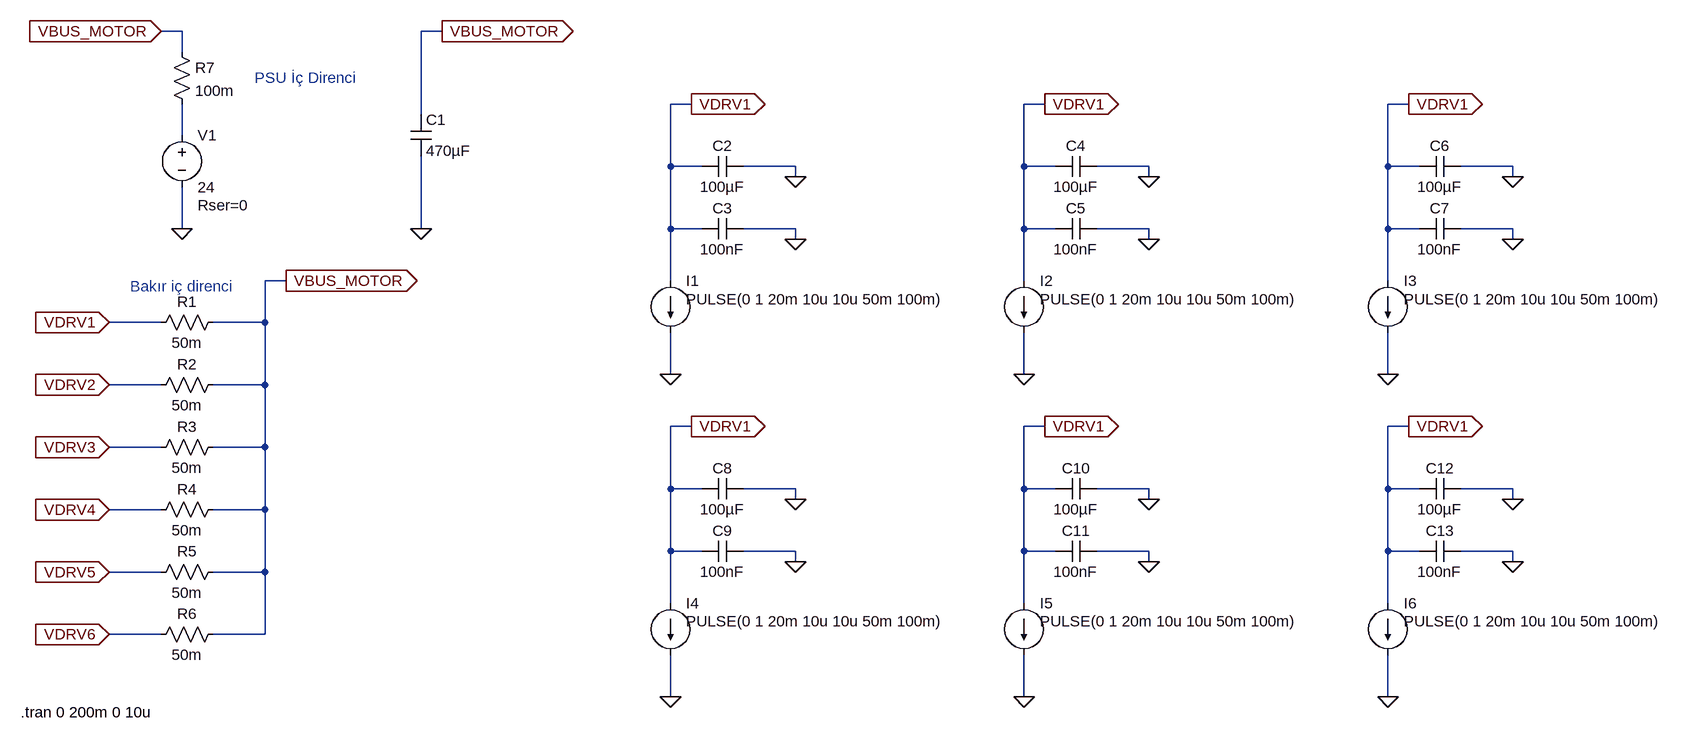
[diagram p0: schematic powerSupply.asc]
powerSupply.asc, the LTspice schematic file:
Version 4.1
SHEET 1 2448 996
WIRE -32 -336 -64 -336
WIRE 368 -336 336 -336
WIRE -32 -304 -32 -336
WIRE 752 -224 720 -224
WIRE 1296 -224 1264 -224
WIRE 1856 -224 1824 -224
WIRE 336 -208 336 -336
WIRE -32 -176 -32 -224
WIRE 720 -128 720 -224
WIRE 768 -128 720 -128
WIRE 912 -128 832 -128
WIRE 1264 -128 1264 -224
WIRE 1312 -128 1264 -128
WIRE 1456 -128 1376 -128
WIRE 1824 -128 1824 -224
WIRE 1872 -128 1824 -128
WIRE 2016 -128 1936 -128
WIRE 912 -112 912 -128
WIRE 1456 -112 1456 -128
WIRE 2016 -112 2016 -128
WIRE -32 -32 -32 -96
WIRE 336 -32 336 -144
WIRE 720 -32 720 -128
WIRE 768 -32 720 -32
WIRE 912 -32 832 -32
WIRE 1264 -32 1264 -128
WIRE 1312 -32 1264 -32
WIRE 1456 -32 1376 -32
WIRE 1824 -32 1824 -128
WIRE 1872 -32 1824 -32
WIRE 2016 -32 1936 -32
WIRE 912 -16 912 -32
WIRE 1456 -16 1456 -32
WIRE 2016 -16 2016 -32
WIRE 128 48 96 48
WIRE 720 48 720 -32
WIRE 1264 48 1264 -32
WIRE 1824 48 1824 -32
WIRE -64 112 -144 112
WIRE 96 112 96 48
WIRE 96 112 16 112
WIRE 720 192 720 128
WIRE 1264 192 1264 128
WIRE 1824 192 1824 128
WIRE -64 208 -144 208
WIRE 96 208 96 112
WIRE 96 208 16 208
WIRE 752 272 720 272
WIRE 1296 272 1264 272
WIRE 1856 272 1824 272
WIRE -64 304 -144 304
WIRE 96 304 96 208
WIRE 96 304 16 304
WIRE 720 368 720 272
WIRE 768 368 720 368
WIRE 912 368 832 368
WIRE 1264 368 1264 272
WIRE 1312 368 1264 368
WIRE 1456 368 1376 368
WIRE 1824 368 1824 272
WIRE 1872 368 1824 368
WIRE 2016 368 1936 368
WIRE 912 384 912 368
WIRE 1456 384 1456 368
WIRE 2016 384 2016 368
WIRE -64 400 -144 400
WIRE 96 400 96 304
WIRE 96 400 16 400
WIRE 720 464 720 368
WIRE 768 464 720 464
WIRE 912 464 832 464
WIRE 1264 464 1264 368
WIRE 1312 464 1264 464
WIRE 1456 464 1376 464
WIRE 1824 464 1824 368
WIRE 1872 464 1824 464
WIRE 2016 464 1936 464
WIRE 912 480 912 464
WIRE 1456 480 1456 464
WIRE 2016 480 2016 464
WIRE -64 496 -144 496
WIRE 96 496 96 400
WIRE 96 496 16 496
WIRE 720 544 720 464
WIRE 1264 544 1264 464
WIRE 1824 544 1824 464
WIRE -64 592 -144 592
WIRE 96 592 96 496
WIRE 96 592 16 592
WIRE 720 688 720 624
WIRE 1264 688 1264 624
WIRE 1824 688 1824 624
FLAG -64 -336 VBUS_MOTOR
IOPIN -64 -336 In
FLAG -144 112 VDRV1
IOPIN -144 112 In
FLAG -32 -32 0
FLAG 368 -336 VBUS_MOTOR
IOPIN 368 -336 Out
FLAG 336 -32 0
FLAG 128 48 VBUS_MOTOR
IOPIN 128 48 Out
FLAG 752 -224 VDRV1
IOPIN 752 -224 Out
FLAG 912 -112 0
FLAG 912 -16 0
FLAG 720 192 0
FLAG -144 208 VDRV2
IOPIN -144 208 In
FLAG -144 304 VDRV3
IOPIN -144 304 In
FLAG -144 400 VDRV4
IOPIN -144 400 In
FLAG -144 496 VDRV5
IOPIN -144 496 In
FLAG -144 592 VDRV6
IOPIN -144 592 In
FLAG 1296 -224 VDRV1
IOPIN 1296 -224 Out
FLAG 1456 -112 0
FLAG 1456 -16 0
FLAG 1264 192 0
FLAG 1856 -224 VDRV1
IOPIN 1856 -224 Out
FLAG 2016 -112 0
FLAG 2016 -16 0
FLAG 1824 192 0
FLAG 752 272 VDRV1
IOPIN 752 272 Out
FLAG 912 384 0
FLAG 912 480 0
FLAG 720 688 0
FLAG 1296 272 VDRV1
IOPIN 1296 272 Out
FLAG 1456 384 0
FLAG 1456 480 0
FLAG 1264 688 0
FLAG 1856 272 VDRV1
IOPIN 1856 272 Out
FLAG 2016 384 0
FLAG 2016 480 0
FLAG 1824 688 0
SYMBOL voltage -32 -192 R0
WINDOW 123 0 0 Left 0
WINDOW 39 24 124 Left 2
SYMATTR InstName V1
SYMATTR Value 24
SYMATTR SpiceLine Rser=0
SYMBOL cap 320 -208 R0
SYMATTR InstName C1
SYMATTR Value 470µF
SYMBOL res 32 96 R90
WINDOW 0 0 56 VBottom 2
WINDOW 3 32 56 VTop 2
SYMATTR InstName R1
SYMATTR Value 50m
SYMBOL cap 832 -144 R90
WINDOW 0 0 32 VBottom 2
WINDOW 3 32 32 VTop 2
SYMATTR InstName C2
SYMATTR Value 100µF
SYMBOL cap 832 -48 R90
WINDOW 0 0 32 VBottom 2
WINDOW 3 32 32 VTop 2
SYMATTR InstName C3
SYMATTR Value 100nF
SYMBOL current 720 48 R0
WINDOW 3 24 28 Left 2
WINDOW 123 0 0 Left 0
WINDOW 39 0 0 Left 0
SYMATTR InstName I1
SYMATTR Value PULSE(0 1 20m 10u 10u 50m 100m)
SYMBOL res 32 192 R90
WINDOW 0 0 56 VBottom 2
WINDOW 3 32 56 VTop 2
SYMATTR InstName R2
SYMATTR Value 50m
SYMBOL res 32 288 R90
WINDOW 0 0 56 VBottom 2
WINDOW 3 32 56 VTop 2
SYMATTR InstName R3
SYMATTR Value 50m
SYMBOL res 32 384 R90
WINDOW 0 0 56 VBottom 2
WINDOW 3 32 56 VTop 2
SYMATTR InstName R4
SYMATTR Value 50m
SYMBOL res 32 480 R90
WINDOW 0 0 56 VBottom 2
WINDOW 3 32 56 VTop 2
SYMATTR InstName R5
SYMATTR Value 50m
SYMBOL res 32 576 R90
WINDOW 0 0 56 VBottom 2
WINDOW 3 32 56 VTop 2
SYMATTR InstName R6
SYMATTR Value 50m
SYMBOL cap 1376 -144 R90
WINDOW 0 0 32 VBottom 2
WINDOW 3 32 32 VTop 2
SYMATTR InstName C4
SYMATTR Value 100µF
SYMBOL cap 1376 -48 R90
WINDOW 0 0 32 VBottom 2
WINDOW 3 32 32 VTop 2
SYMATTR InstName C5
SYMATTR Value 100nF
SYMBOL current 1264 48 R0
WINDOW 3 24 28 Left 2
WINDOW 123 0 0 Left 0
WINDOW 39 0 0 Left 0
SYMATTR InstName I2
SYMATTR Value PULSE(0 1 20m 10u 10u 50m 100m)
SYMBOL cap 1936 -144 R90
WINDOW 0 0 32 VBottom 2
WINDOW 3 32 32 VTop 2
SYMATTR InstName C6
SYMATTR Value 100µF
SYMBOL cap 1936 -48 R90
WINDOW 0 0 32 VBottom 2
WINDOW 3 32 32 VTop 2
SYMATTR InstName C7
SYMATTR Value 100nF
SYMBOL current 1824 48 R0
WINDOW 3 24 28 Left 2
WINDOW 123 0 0 Left 0
WINDOW 39 0 0 Left 0
SYMATTR InstName I3
SYMATTR Value PULSE(0 1 20m 10u 10u 50m 100m)
SYMBOL cap 832 352 R90
WINDOW 0 0 32 VBottom 2
WINDOW 3 32 32 VTop 2
SYMATTR InstName C8
SYMATTR Value 100µF
SYMBOL cap 832 448 R90
WINDOW 0 0 32 VBottom 2
WINDOW 3 32 32 VTop 2
SYMATTR InstName C9
SYMATTR Value 100nF
SYMBOL current 720 544 R0
WINDOW 3 24 28 Left 2
WINDOW 123 0 0 Left 0
WINDOW 39 0 0 Left 0
SYMATTR InstName I4
SYMATTR Value PULSE(0 1 20m 10u 10u 50m 100m)
SYMBOL cap 1376 352 R90
WINDOW 0 0 32 VBottom 2
WINDOW 3 32 32 VTop 2
SYMATTR InstName C10
SYMATTR Value 100µF
SYMBOL cap 1376 448 R90
WINDOW 0 0 32 VBottom 2
WINDOW 3 32 32 VTop 2
SYMATTR InstName C11
SYMATTR Value 100nF
SYMBOL current 1264 544 R0
WINDOW 3 24 28 Left 2
WINDOW 123 0 0 Left 0
WINDOW 39 0 0 Left 0
SYMATTR InstName I5
SYMATTR Value PULSE(0 1 20m 10u 10u 50m 100m)
SYMBOL cap 1936 352 R90
WINDOW 0 0 32 VBottom 2
WINDOW 3 32 32 VTop 2
SYMATTR InstName C12
SYMATTR Value 100µF
SYMBOL cap 1936 448 R90
WINDOW 0 0 32 VBottom 2
WINDOW 3 32 32 VTop 2
SYMATTR InstName C13
SYMATTR Value 100nF
SYMBOL current 1824 544 R0
WINDOW 3 24 28 Left 2
WINDOW 123 0 0 Left 0
WINDOW 39 0 0 Left 0
SYMATTR InstName I6
SYMATTR Value PULSE(0 1 20m 10u 10u 50m 100m)
SYMBOL res -48 -320 R0
SYMATTR InstName R7
SYMATTR Value 100m
TEXT -112 56 Left 2 ;Bakır iç direnci
TEXT 80 -264 Left 2 ;PSU İç Direnci
TEXT -280 712 Left 2 !.tran 0 200m 0 10u

The netlist it stands for:
* powerSupply.asc
V1 N001 0 24 Rser=0
C1 VBUS_MOTOR 0 470µF
R1 VBUS_MOTOR VDRV1 50m
C2 0 VDRV1 100µF
C3 0 VDRV1 100nF
I1 VDRV1 0 PULSE(0 1 20m 10u 10u 50m 100m)
R2 VBUS_MOTOR VDRV2 50m
R3 VBUS_MOTOR VDRV3 50m
R4 VBUS_MOTOR VDRV4 50m
R5 VBUS_MOTOR VDRV5 50m
R6 VBUS_MOTOR VDRV6 50m
C4 0 VDRV1 100µF
C5 0 VDRV1 100nF
I2 VDRV1 0 PULSE(0 1 20m 10u 10u 50m 100m)
C6 0 VDRV1 100µF
C7 0 VDRV1 100nF
I3 VDRV1 0 PULSE(0 1 20m 10u 10u 50m 100m)
C8 0 VDRV1 100µF
C9 0 VDRV1 100nF
I4 VDRV1 0 PULSE(0 1 20m 10u 10u 50m 100m)
C10 0 VDRV1 100µF
C11 0 VDRV1 100nF
I5 VDRV1 0 PULSE(0 1 20m 10u 10u 50m 100m)
C12 0 VDRV1 100µF
C13 0 VDRV1 100nF
I6 VDRV1 0 PULSE(0 1 20m 10u 10u 50m 100m)
R7 VBUS_MOTOR N001 100m
* Bakır iç direnci
* PSU İç Direnci
.tran 0 200m 0 10u
.backanno
.end

* Results of the author's LTspice run, read from the files saved beside the schematic
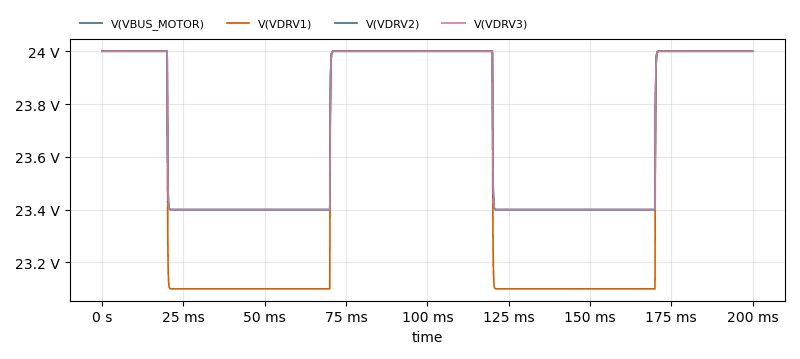
[diagram p1: Transient Analysis of powerSupply.asc, plotted from the saved traces]
* Transient Analysis, 1 run:
*   V(VBUS_MOTOR): min 23.4 V, max 24 V, average 23.7 V, rms 23.7 V, last 24 V
*   V(VDRV1): min 23.1 V, max 24 V, average 23.55 V, rms 23.55 V, last 24 V
*   V(VDRV2): min 23.4 V, max 24 V, average 23.7 V, rms 23.7 V, last 24 V
*   V(VDRV3): min 23.4 V, max 24 V, average 23.7 V, rms 23.7 V, last 24 V